# EAGLE design simreader_v10 (EAGLE 6.6.0)
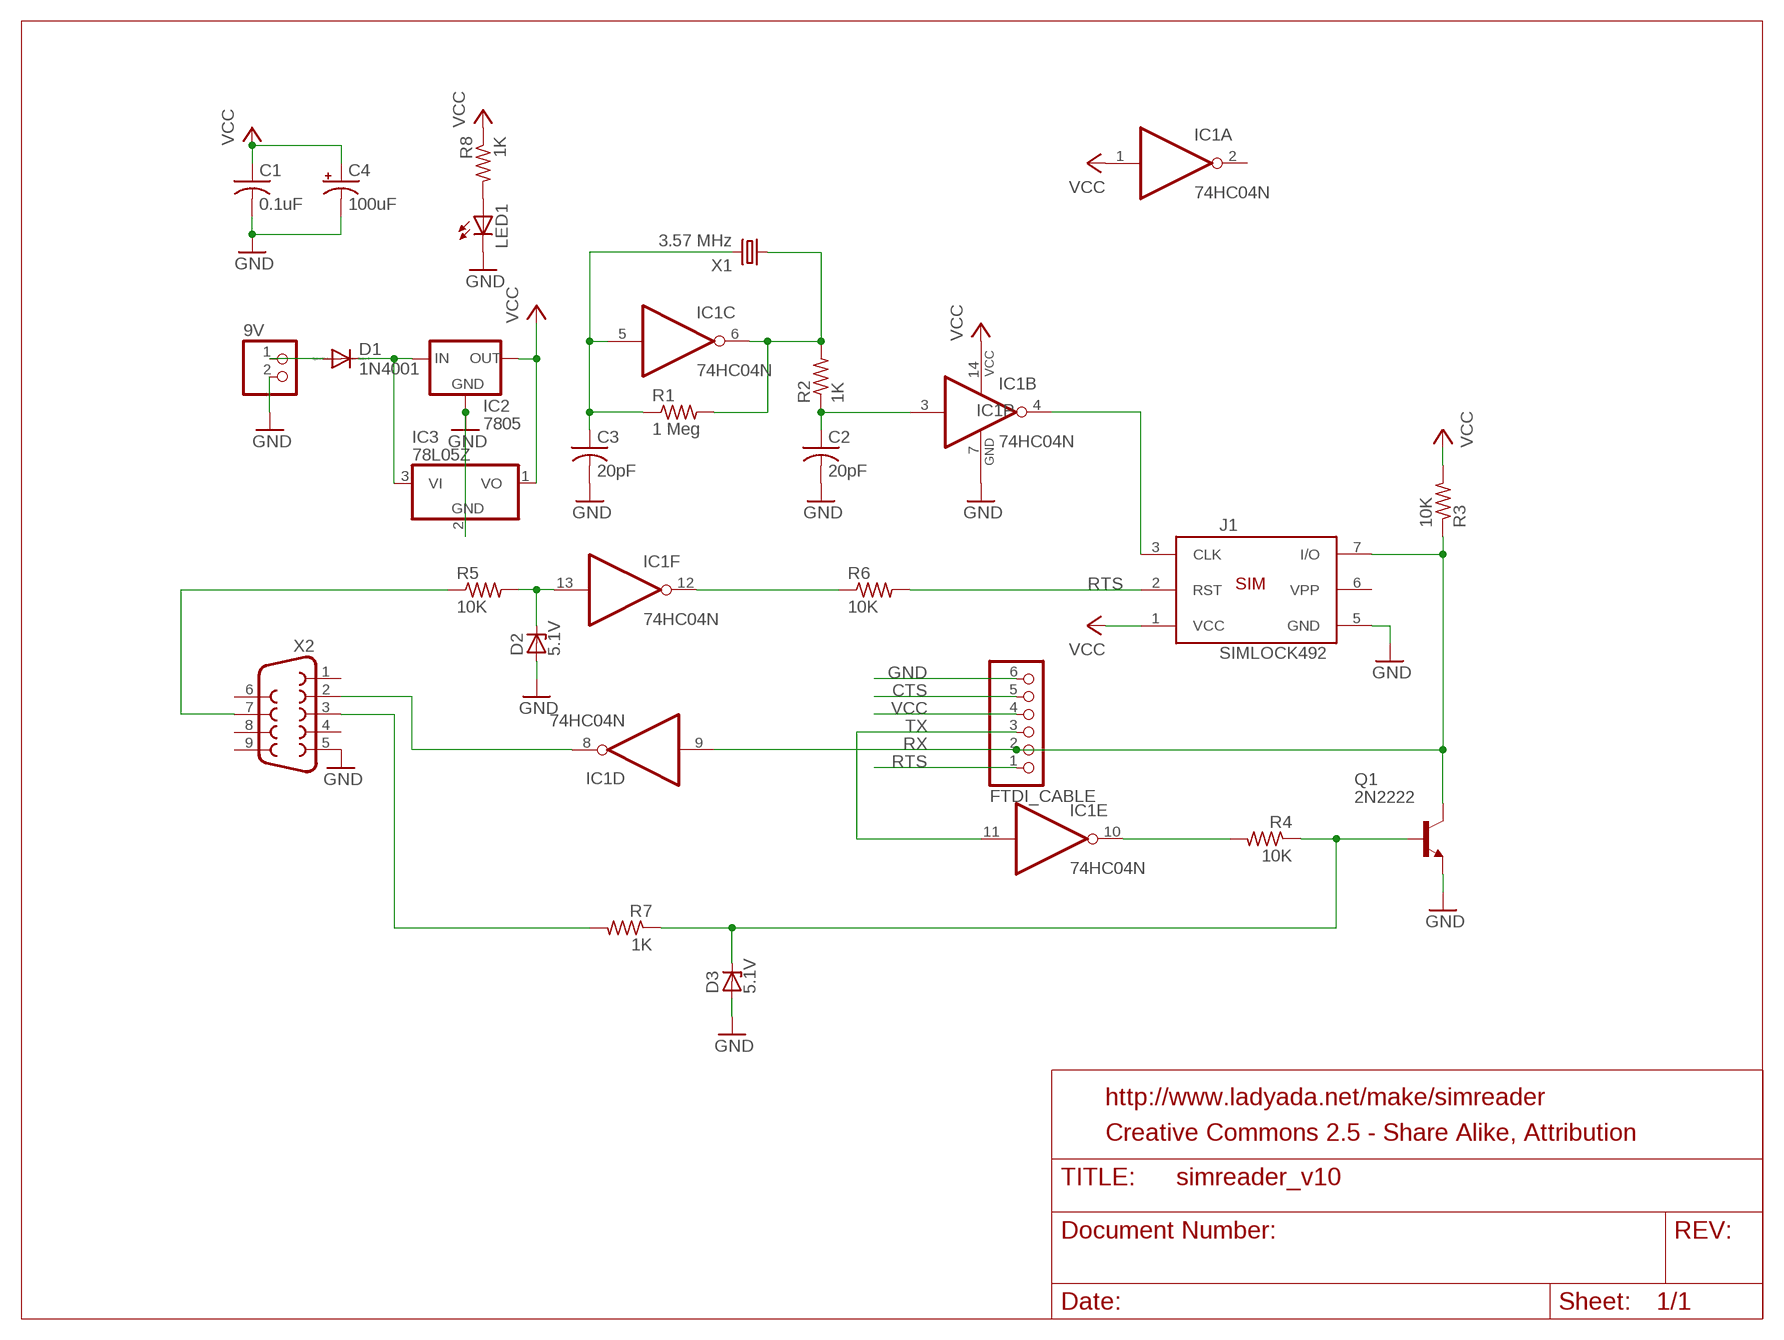
[diagram p0: schematic, sheet 1]

## Parts
9V  PINHD-1X2  [1X02]
C1  0.1uF  C-US025-025X050  [C025-025X050]
C2  20pF  C-US025-025X050  [C025-025X050]
C3  20pF  C-US025-025X050  [C025-025X050]
C4  100uF  CPOL-USE2.5-5  [E2,5-5]
D1  1N4001  1N4004  [DO41-10]
D2  5.1V  ZENER-DIODEDO35Z10  [DO35Z10]
D3  5.1V  ZENER-DIODEDO35Z10  [DO35Z10]
FTDI_CABLE  PINHD-1X6  [1X06]
IC1  74HC04N  74LS04N  [DIL14]
IC2  7805  78XXS  [78XXS]
IC3  78L05Z  [TO92]
J1  SIMLOCK492  [5002]
LED1  LED3MM  [LED3MM]
Q1  2N2222  [TO92-EBC]
R1  1 Meg  R-US_0207/10  [0207/10]
R2  1K  R-US_0207/10  [0207/10]
R3  10K  R-US_0207/10  [0207/10]
R4  10K  R-US_0207/10  [0207/10]
R5  10K  R-US_0207/10  [0207/10]
R6  10K  R-US_0207/10  [0207/10]
R7  1K  R-US_0207/10  [0207/10]
R8  1K  R-US_0207/10  [0207/10]
X1  3.57 MHz  CRYSTAL  [HC49]
X2  F09D  [F09D]

## Nets
CTS: FTDI_CABLE.5
GND: 9V.2 C1.2 C2.2 C3.2 C4.- D2.A D3.A FTDI_CABLE.6 IC1.7(P:GND) IC2.GND IC3.2(GND) J1.5(GND) LED1.K(C) Q1.E X2.5
N$1: C3.1 IC1.5(C:I) R1.1 X1.2
N$2: IC1.6(C:O) R1.2 R2.2 X1.1
N$3: C2.1 IC1.3(B:I) R2.1
N$4: IC1.10(E:O) R4.2
N$5: IC1.4(B:O) J1.3(CLK)
N$6: D3.C Q1.B R4.1 R7.1
N$7: D1.C IC2.IN IC3.3(VI)
N$8: IC1.8(D:O) X2.2
N$9: R5.1 X2.7
N$10: D2.C IC1.13(F:I) R5.2
N$11: IC1.12(F:O) R6.1
N$12: R7.2 X2.3
N$13: LED1.A R8.2
N$14: 9V.1 D1.A
RTS: FTDI_CABLE.1 J1.2(RST) R6.2
RX: FTDI_CABLE.2 IC1.9(D:I) J1.7(I/O) Q1.C R3.1
TX: FTDI_CABLE.3 IC1.11(E:I)
VCC: C1.1 C4.+ FTDI_CABLE.4 IC1.1(A:I) IC1.14(P:VCC) IC2.OUT IC3.1(VO) J1.1(VCC) R3.2 R8.1
Unconnected: IC1.2(A:O) J1.6(VPP) X2.1 X2.4 X2.6 X2.8 X2.9

## Notes on the sheet
- http://www.ladyada.net/make/simreader
- Creative Commons 2.5 - Share Alike, Attribution

## Library data of the parts
9V = pinhead:PINHD-1X2: PIN HEADER
C1-C3 = rcl-ez:C-US: CAPACITOR, American symbol
C4 = rcl-ez:CPOL-US: POLARIZED CAPACITOR, American symbol
D1 = diode:1N4004: DIODE general purpose rectifier, 1 A
D2 D3 = diode:ZENER-DIODE: Z-Diode
FTDI_CABLE = pinhead:PINHD-1X6: PIN HEADER
IC1 = 74xx-us:74*04: Hex INVERTER
IC2 = v-reg:78XXS: VOLTAGE REGULATOR
IC3 = linear-ez:78*: Positive VOLTAGE REGULATOR
J1 = sim:SIMLOCK492
LED1 = led-ez:LED: LED OSRAM: - CHIPLED LG R971, LG N971, LY N971, LG Q971, LY Q971, LO R971, LY R971 LH N974, LH R974 LS Q976, LO Q976, LY Q976 LO Q996 - Hyper CHIPLED LW Q18S LB Q993, LB Q99A, LB R99A - SideLED LS A670, LO A670, LY A670, LG A670, LP A670 LB A673, LV A673, LT A673, LW A673 LH A674 LY A675 LS A676, LA A676, LO A676, LY A676, LW A676 LS A679, LY A679, LG A679 - Hyper Micro SIDELED® LS Y876, LA Y876, LO Y876, LY Y876 LT Y87S - SmartLED LW L88C, LW L88S LB L89C, LB L89S, LG L890 LS L89K, LO L89K, LY L89K LS L896, LA L896, LO L896, LY L896 - TOPLED LS T670, LO T670, LY T670, LG T670, LP T670 LSG T670, LSP T670, LSY T670, LOP T670, LYG T670 LG T671, LOG T671, LSG T671 LB T673, LV T673, LT T673, LW T673 LH T674 LS T676, LA T676, LO T676, LY T676, LB T676, LH T676, LSB T676, LW T676 LB T67C, LV T67C, LT T67C, LS T67K, LO T67K, LY T67K, LW E67C LS E67B, LA E67B, LO E67B, LY E67B, LB E67C, LV E67C, LT E67C LW T67C LS T679, LY T679, LG T679 LS T770, LO T770, LY T770, LG T770, LP T770 LB T773, LV T773, LT T773, LW T773 LH T774 LS E675, LA E675, LY E675, LS T675 LS T776, LA T776, LO T776, LY T776, LB T776 LHGB T686 LT T68C, LB T68C - Hyper Mini TOPLED® LB M676 - Mini TOPLED Santana® LG M470 LS M47K, LO M47K, LY M47K Source: http://www.osram.convergy.de/
Q1 = sim:2N2222: NPN TRANSISTOR
R1-R8 = rcl-ez:R-US_: RESISTOR, American symbol
X1 = sim:CRYSTAL
X2 = con-subd:F09: SUB-D; OC_FARNELL: unknown; OC_NEWARK: unknown

## Board
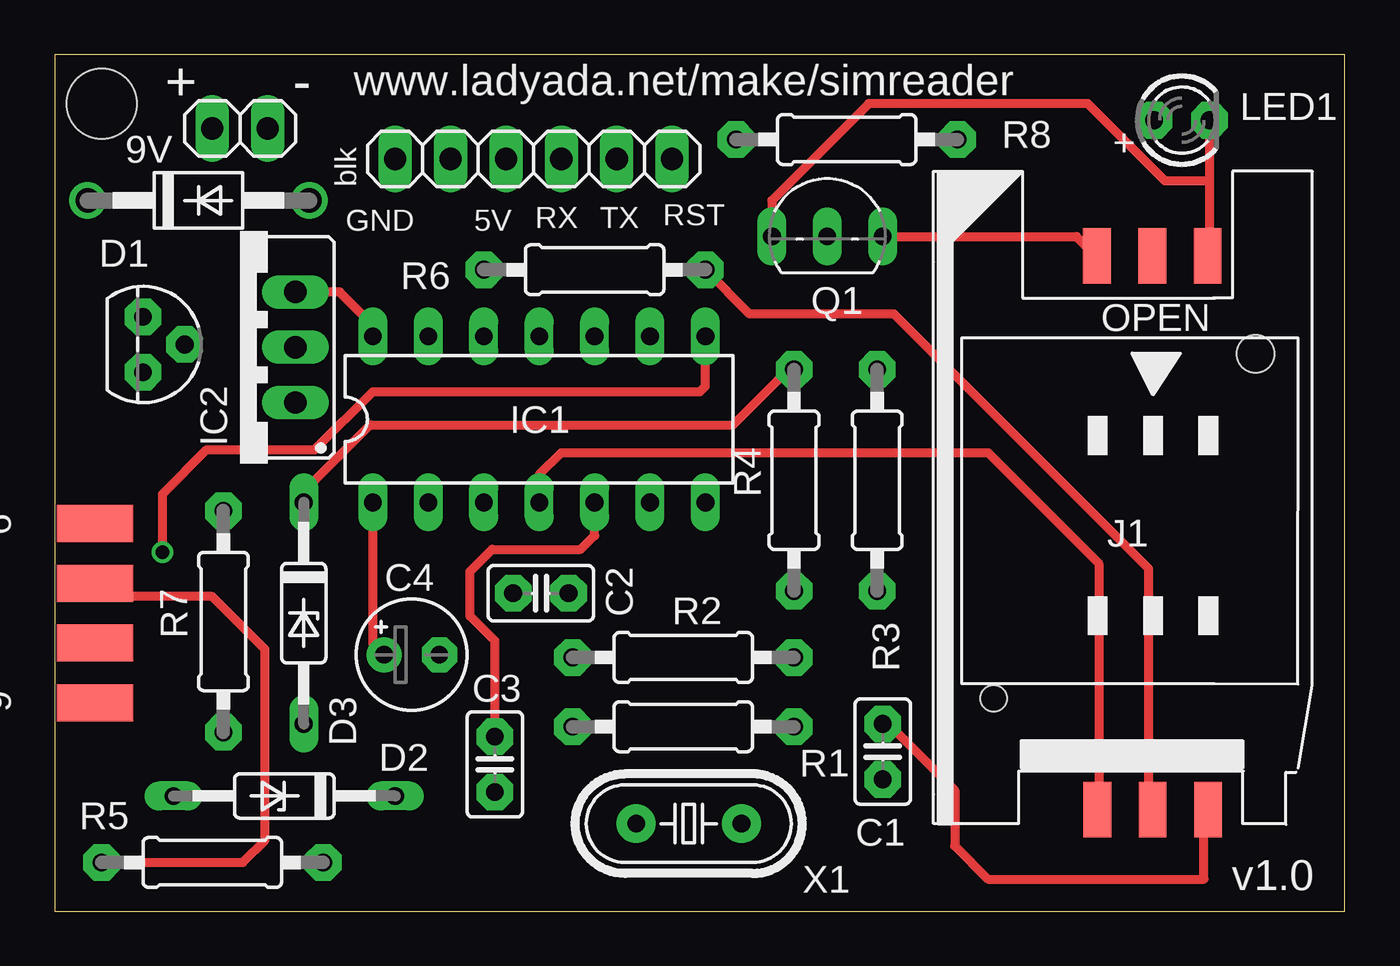
[diagram p1: board, top side]
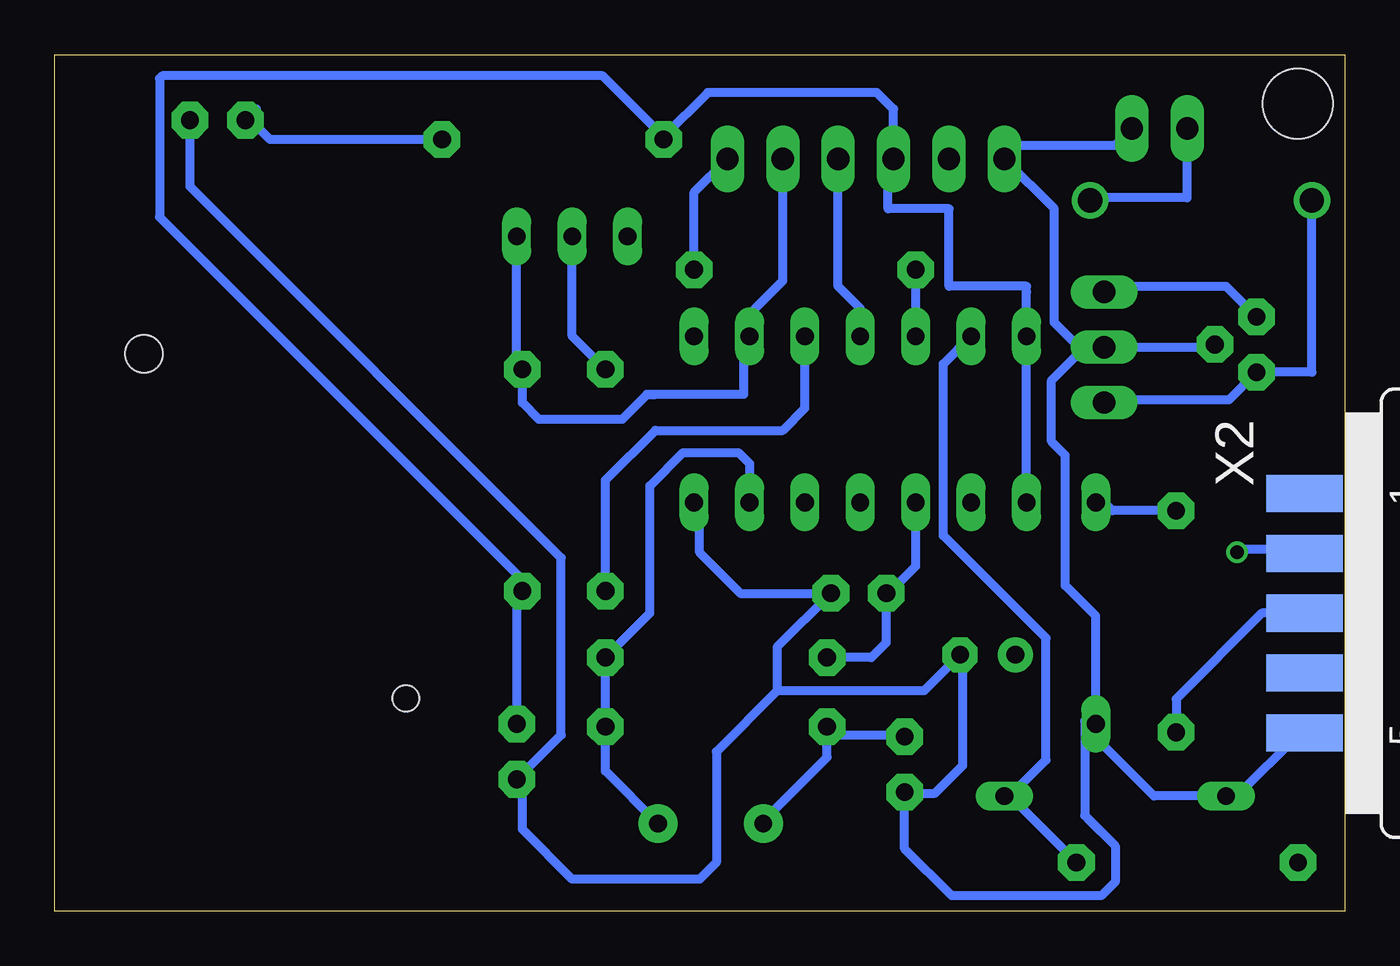
[diagram p2: board, bottom side, seen from below]

Size 59.16 x 39.29 mm. Coordinates in mm from the lower left corner, seen from the top.
Outline: 0,0 59.16,0 59.16,39.29 0,39.29 0,0
Copper layers (1*16): Top 0.035mm / dielectric 1.5mm / Bottom 0.035mm
Design rules "default *": minimum track width 10mil, minimum drill 20mil, track to track 12mil, track to pad 12mil, pad to pad 12mil, via to via 12mil, smd to smd 0mil, copper to edge 0mil, drill to drill 8mil, minimum pad ring 10mil, minimum via ring 8mil, stop-mask expansion 4mil, vias tented up to drill 0mil, thermal gap 10mil
Holes 3.2 mm at 2.15,37.05

### Footprints (pad centres in the part's own frame; a part is rotated, then mirrored left to right if it is on the bottom)
1X02 = drill 1.016 long: 1 -1.27,0; 2 1.27,0
C025-025X050 = drill 0.813 pad 1.676 octagon: 1 -1.27,0; 2 1.27,0
E2,5-5 = drill 0.813 pad 1.6: + -1.27,0 | drill 0.813 pad 1.6 octagon: - 1.27,0
DO41-10 = drill 1.118: A 5.08,0; C -5.08,0
DO35Z10 = drill 0.813 long: A 5.08,0; C -5.08,0
1X06 = drill 1.016 long: 1 -6.35,0; 2 -3.81,0; 3 -1.27,0; 4 1.27,0; 5 3.81,0; 6 6.35,0
DIL14 = drill 0.813 long: 1 -7.62,-3.81; 2 -5.08,-3.81; 3 -2.54,-3.81; 4 0,-3.81; 5 2.54,-3.81; 6 5.08,-3.81; 7 7.62,-3.81; 8 7.62,3.81; 9 5.08,3.81; 10 2.54,3.81; 11 0,3.81; 12 -2.54,3.81; 13 -5.08,3.81; 14 -7.62,3.81
78XXS = drill 1.016 long: GND 0,-2.54; IN -2.54,-2.54; OUT 2.54,-2.54
TO92 = drill 0.813 pad 1.676 octagon: 1 -1.27,0; 2 0,1.905; 3 1.27,0
5002 = smd 2.54 x 1.27: 1 0.904,0.574; 2 0.904,3.114; 3 0.904,5.654; 5 26.299,0.594; 6 26.299,3.134; 7 26.299,5.674 | hole 1.7: 21.8,-1.6 | hole 1.2: 6,10.4
LED3MM = drill 0.813 pad 1.676 octagon: A -1.27,0; K 1.27,0
TO92-EBC = drill 0.813 long: B 0,-1.27; C 2.54,-1.27; E -2.54,-1.27
0207/10 = drill 0.813 pad 1.676 octagon: 1 -5.08,0; 2 5.08,0
HC49 = drill 0.813 pad 1.778: 1 -2.413,0; 2 2.413,0
F09D = smd 1.7 x 3.5: 1 -5.486,-6.045; 2 -2.743,-6.045; 3 0,-6.045; 4 2.743,-6.045; 5 5.486,-6.045 | smd 1.7 x 3.5 bottom: 6 -4.115,-6.045; 7 -1.372,-6.045; 8 1.372,-6.045; 9 4.115,-6.045

### Placement (x,y rotation side)
9V  8.5,35.9 0 top
C1  37.97,7.33 270 top
C2  22.3,14.59 0 top
C3  20.19,6.74 270 top
C4  16.38,11.77 0 top
D1  6.6,32.6 0 top
D2  10.54,5.3 180 top
D3  11.43,13.68 270 top
FTDI_CABLE  21.97,34.51 180 top
IC1  22.22,22.57 0 top
IC2  8.5,25.87 90 top
IC3  4.06,26 270 top
J1  53.46,3.77 90 top
LED1  51.68,36.28 0 top
Q1  35.43,32.22 0 top
R1  28.82,8.47 0 top
R2  28.82,11.65 0 top
R3  37.71,19.77 270 top
R4  33.9,19.77 270 top
R5  7.23,2.25 0 top
R6  24.76,29.43 0 top
R7  7.74,13.3 270 top
R8  36.32,35.4 0 top
X1  29.08,4.03 180 top
X2  -4.2,13.68 270 bottom

### Tracks (layer width: path | path; a pad name or v marks a point on that pad's centre or on a via)
GND
  Top 0.406: J1.5 52.95,30.16 52.95,33.49 | LED1.K 52.95,34.51 | 52.95,34.51 52.95,34.25 | 52.95,34.51 52.95,33.49 | Q1.E 32.89,32.6 37.33,37.05 47.37,37.05 50.92,33.49 52.95,33.49
  Bottom 0.406: IC1.7 29.59,18.5 29.59,16.47 27.68,14.57 23.54,14.57 | 26.03,10.12 28.82,7.33 28.82,2.25 29.59,1.49 35.43,1.49 37.71,3.77 37.71,6.31 C1.2 35.94,8.09 35.94,16.22 52.95,33.24 LED1.K 52.95,36.54 | 26.03,10.12 19.3,10.12 C4.- 17.52,11.77 17.52,6.69 18.79,5.42 20.19,5.42 | 10.54,3.01 11.81,4.28 | 10.54,3.01 10.54,1.36 11.17,0.72 18.03,0.72 20.19,2.88 20.19,5.42 | D3.A 11.43,7.96 8.76,5.3 D2.A 5.71,5.04 5,5.04 5,5.25 2.05,8.19 X2.5 | 10.54,3.01 11.93,4.41 11.93,8.72 11.43,8.72 D3.A | 9V.2 10.54,35.14 14.98,35.14 FTDI_CABLE.6 13.33,32.22 13.33,27.01 12.06,25.74 | IC2.GND 11.17,25.87 | IC3.2 6.09,25.87 IC2.GND | 12.06,25.74 11.17,25.74 IC2.GND | 12.06,25.74 13.46,24.35 13.46,21.55 12.82,20.92 12.82,14.95 11.43,13.55 D3.A | 20.19,5.42 C3.2 | 23.54,14.57 23.49,14.57 | 23.54,14.57 C2.2 26.03,12.13 26.03,10.12
N$1
  Top 0.406: IC1.5 24.76,17.23 24.12,16.6 20.06,16.6 19.04,15.58 19.04,13.55 20.19,12.41 C3.1
  Bottom 0.406: X1.2 26.79,4.03 23.74,7.07 R1.1 23.36,8.09 20.19,8.09 C3.1
N$2
  Bottom 0.406: X1.1 33.9,6.44 R1.2 R2.2 31.87,13.68 31.87,19.52 30.35,21.04 27.81,21.04 27.3,20.54 IC1.6
N$3
  Bottom 0.406: R2.1 23.74,11.9 | IC1.3 19.68,15.84 20.95,14.57 20.97,14.59 C2.1 21.03,12.33 21.71,11.65 R2.1 | R2.1 23.87,11.77
N$4
  Bottom 0.406: IC1.10 24.76,23.08 25.78,22.06 31.62,22.06 33.9,19.77 R4.2
N$5
  Top 0.406: IC1.4 22.22,20.03 23.24,21.04 42.79,21.04 47.87,15.96 47.87,4.79 47.81,4.72 J1.3
N$6
  Top 0.406: R4.1 33.65,24.85 31.11,22.31 14.47,22.31 11.3,19.14 11.43,19.01 D3.C
  Bottom 0.406: R4.1 35.43,26.38 Q1.B | D3.C 11.43,18.88 11.3,19.01 10.66,18.38 R7.1
N$7
  Bottom 0.406: IC2.IN 10.92,23.46 5.33,23.46 IC3.3 1.52,24.73 D1.C
N$8  (via drill 0.6)
  Top 0.406: IC1.8 29.84,24.09 29.59,23.84 14.6,23.84 11.93,21.17 6.98,21.17 4.95,19.14 v4.95,16.47
  Bottom 0.406: X2.2 2.03,16.6 4.82,16.6 v4.95,16.47
N$9
  Top 0.406: 1.9,2.25 R5.1 8.63,2.25 9.65,3.26 9.65,12.03 7.23,14.44 2.46,14.44 X2.7
N$10
  Bottom 0.406: R5.2 15.36,5.3 | IC1.13 18.41,25.11 18.41,18.63 18.41,17.23 13.71,12.54 13.71,6.95 15.36,5.3 | 15.36,5.3 D2.C
N$11
  Bottom 0.406: IC1.12 R6.1
N$12
  Bottom 0.406: R7.2 7.74,9.74 3.8,13.68 X2.3
N$13
  Bottom 0.406: 50.29,36.41 49.91,36.79 | 50.29,36.41 LED1.A | R8.2 49.27,35.4 50.29,36.41
N$14
  Bottom 0.406: D1.A 11.68,32.73 7.23,32.73 9V.1
RTS
  Top 0.406: R6.2 31.87,27.39 38.48,27.39 50.16,15.71 50.16,4.79 50.24,4.79 J1.2
  Bottom 0.406: FTDI_CABLE.1 29.84,32.98 R6.2
RX
  Top 0.406: 47.87,29.93 47.87,29.98 J1.7 47.74,30.07 46.86,30.95 Q1.C
  Bottom 0.406: Q1.C 37.97,25.11 R3.1 37.71,23.33 36.95,22.57 33.14,22.57 32,23.71 | FTDI_CABLE.2 25.78,28.92 27.05,27.65 27.05,26.89 27.55,26.38 | 27.55,26.38 IC1.9 | 27.55,26.38 27.55,23.71 32,23.71 | 32,23.71 31.62,23.71
TX
  Bottom 0.406: FTDI_CABLE.3 23.24,28.66 22.22,27.65 IC1.11
VCC
  Top 0.406: J1.1 52.7,4.49 52.7,1.49 42.79,1.49 41.27,3.01 41.27,5.55 38.22,8.6 C1.1 | IC1.1 14.6,12.28 C4.+ | IC2.OUT 13.08,28.41 14.47,27.01 14.47,26.63 14.6,26.5 IC1.14
  Bottom 0.406: 14.6,28.41 14.6,27.14 14.85,26.89 14.85,26.38 IC1.14 | IC1.14 14.6,28.66 18.16,28.66 18.16,32.22 20.95,32.22 20.95,34.51 FTDI_CABLE.4 20.7,36.79 21.46,37.55 29.2,37.55 31.24,35.52 | IC1.1 IC1.14 | C1.1 37.97,14.44 R3.2 37.46,14.95 54.35,31.84 54.35,38.19 54.22,38.32 34.03,38.32 31.24,35.52 | 31.24,35.52 R8.1 | IC2.OUT 11.04,28.66 5.46,28.66 IC3.1

### Text on the board
tPlace: + | - | www.ladyada.net/make/simreader | + | blk | RST | GND | 5V | RX | TX | v1.0